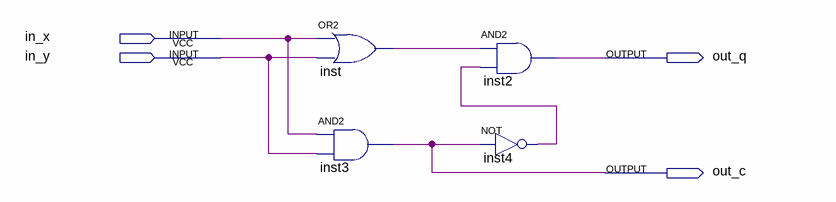
[diagram p0: schematic sheet]
// Quartus schematic SM1_Kulikov.bdf as structural Verilog: 4 symbols, 4 pins
module SM1_Kulikov (
  input  in_x,
  input  in_y,
  output out_q,
  output out_c
);

  wire inst4_out, inst_out;

  or inst (inst_out, in_x, in_y);
  and inst3 (out_c, in_x, in_y);
  and inst2 (out_q, inst_out, inst4_out);
  not inst4 (inst4_out, out_c);
endmodule
